# EAGLE design Indev 4_test (EAGLE 6.4)
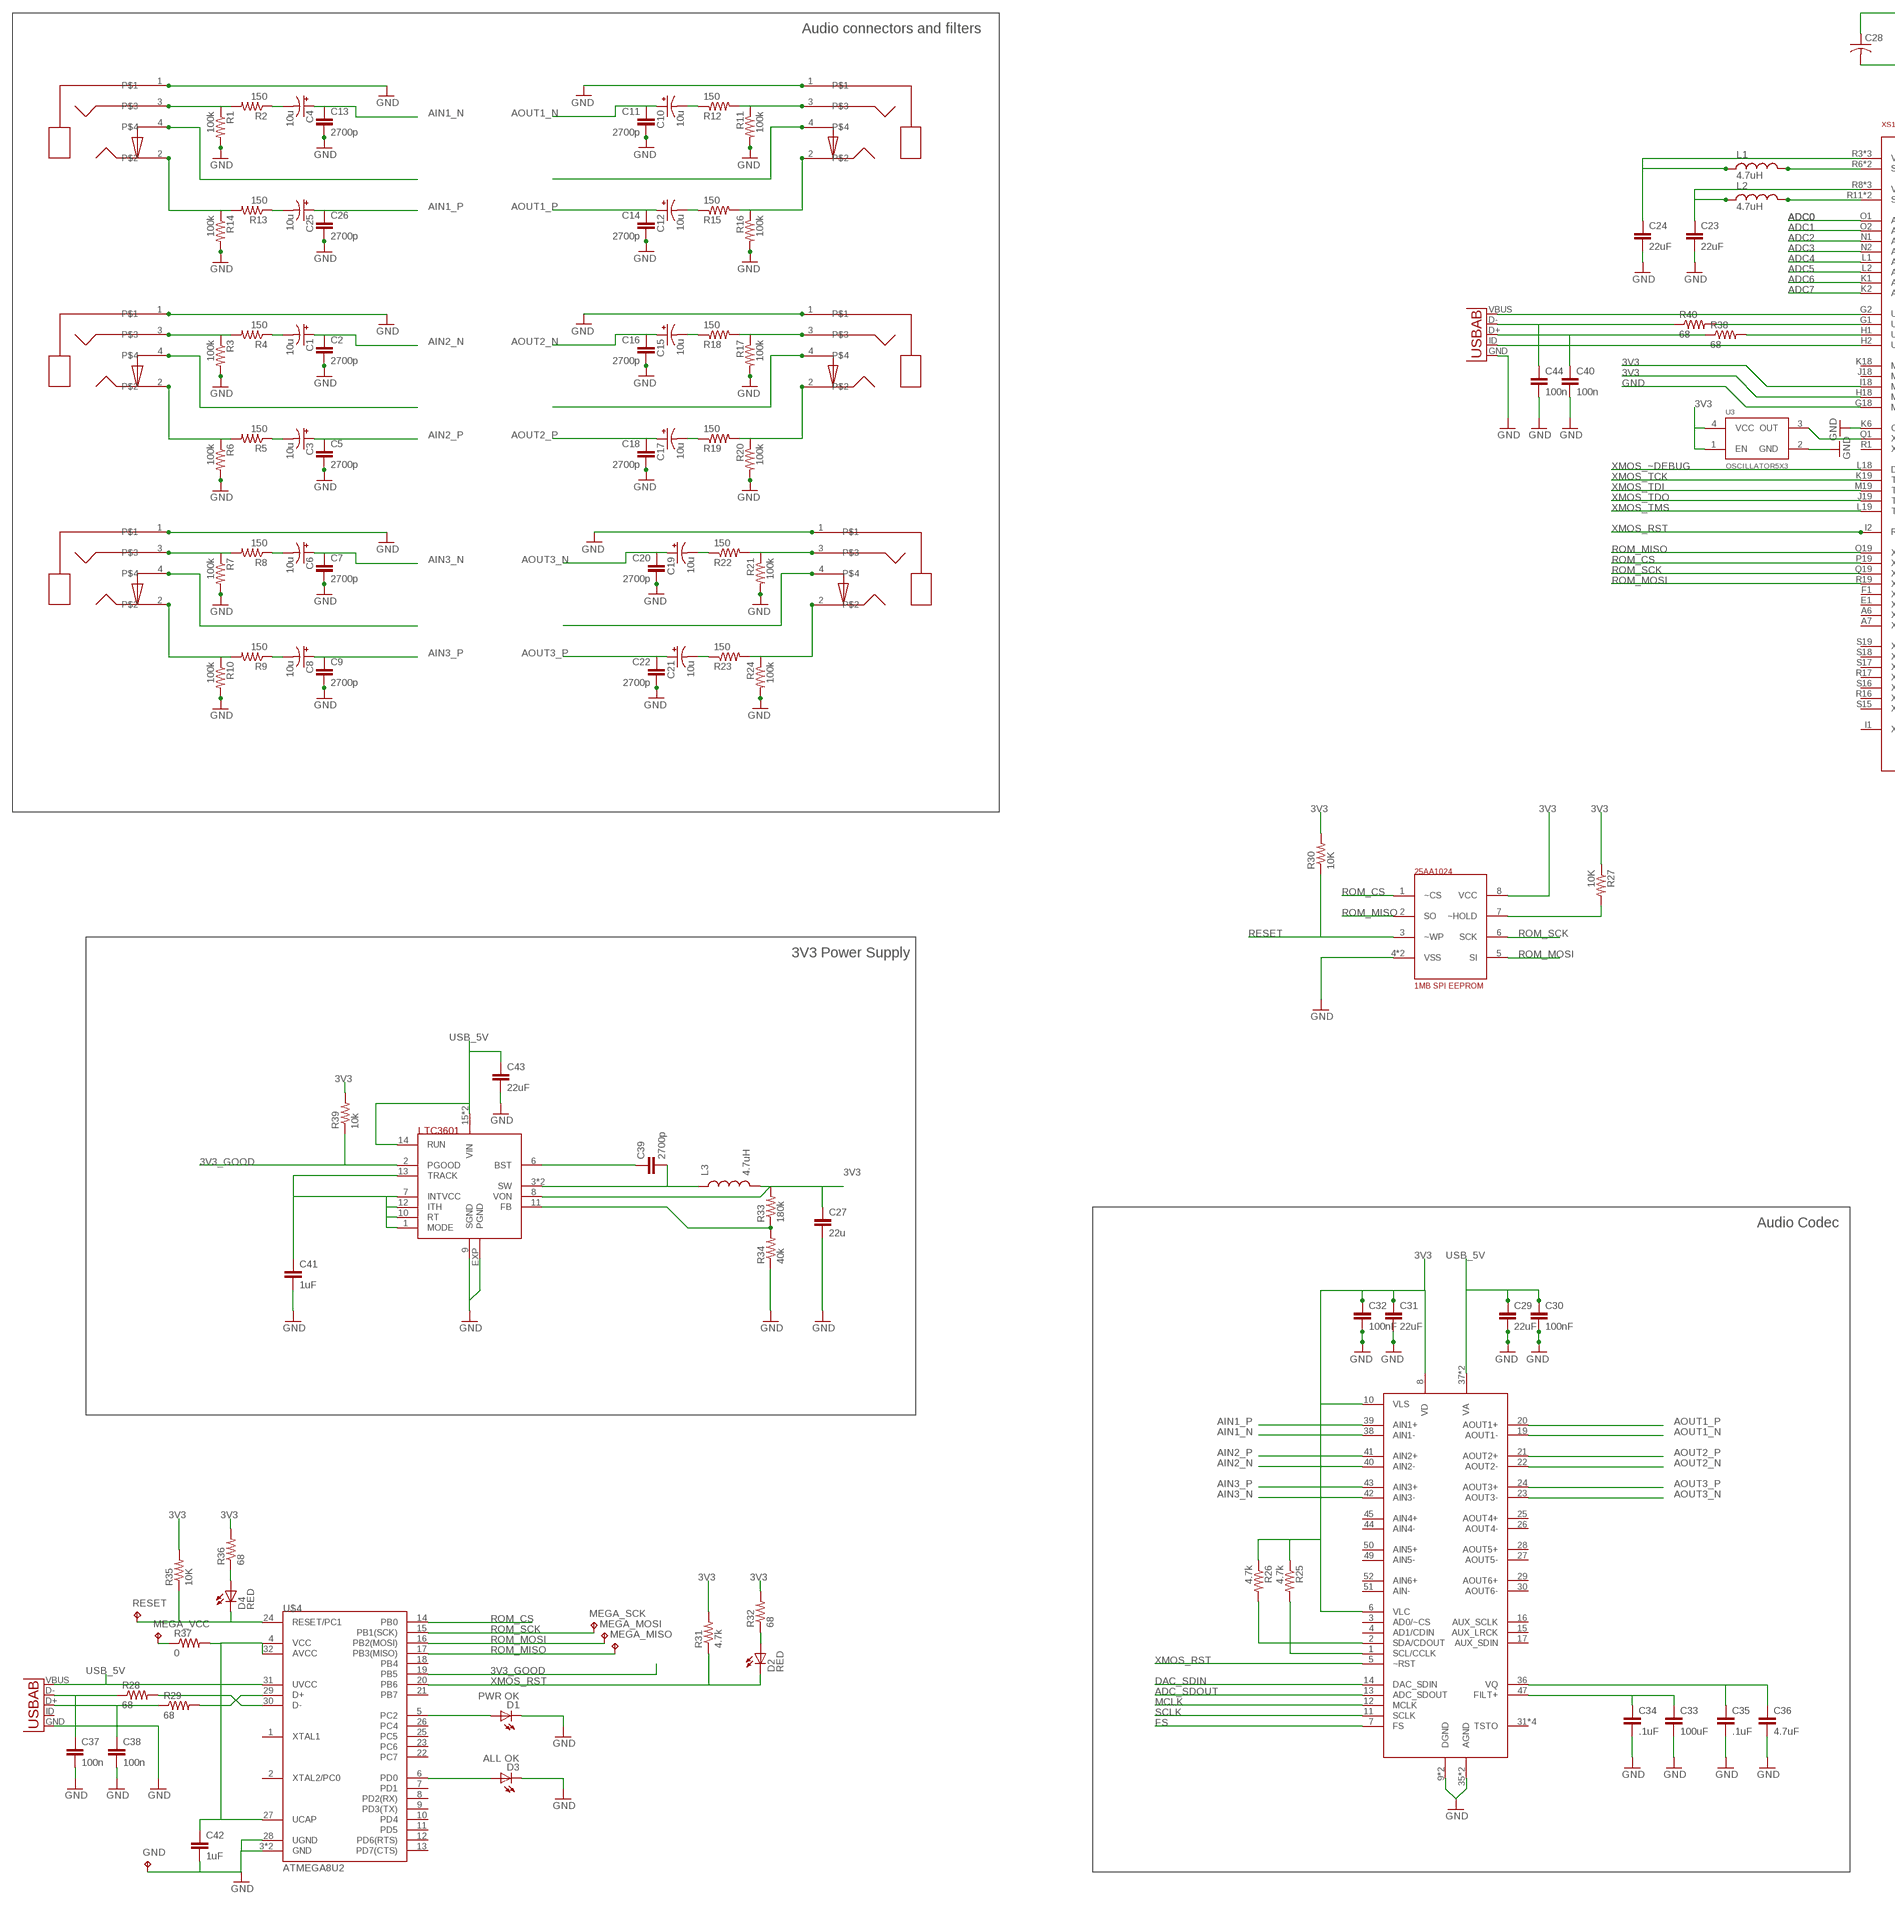
[diagram p0: schematic, sheet 1, part 1 of 2]
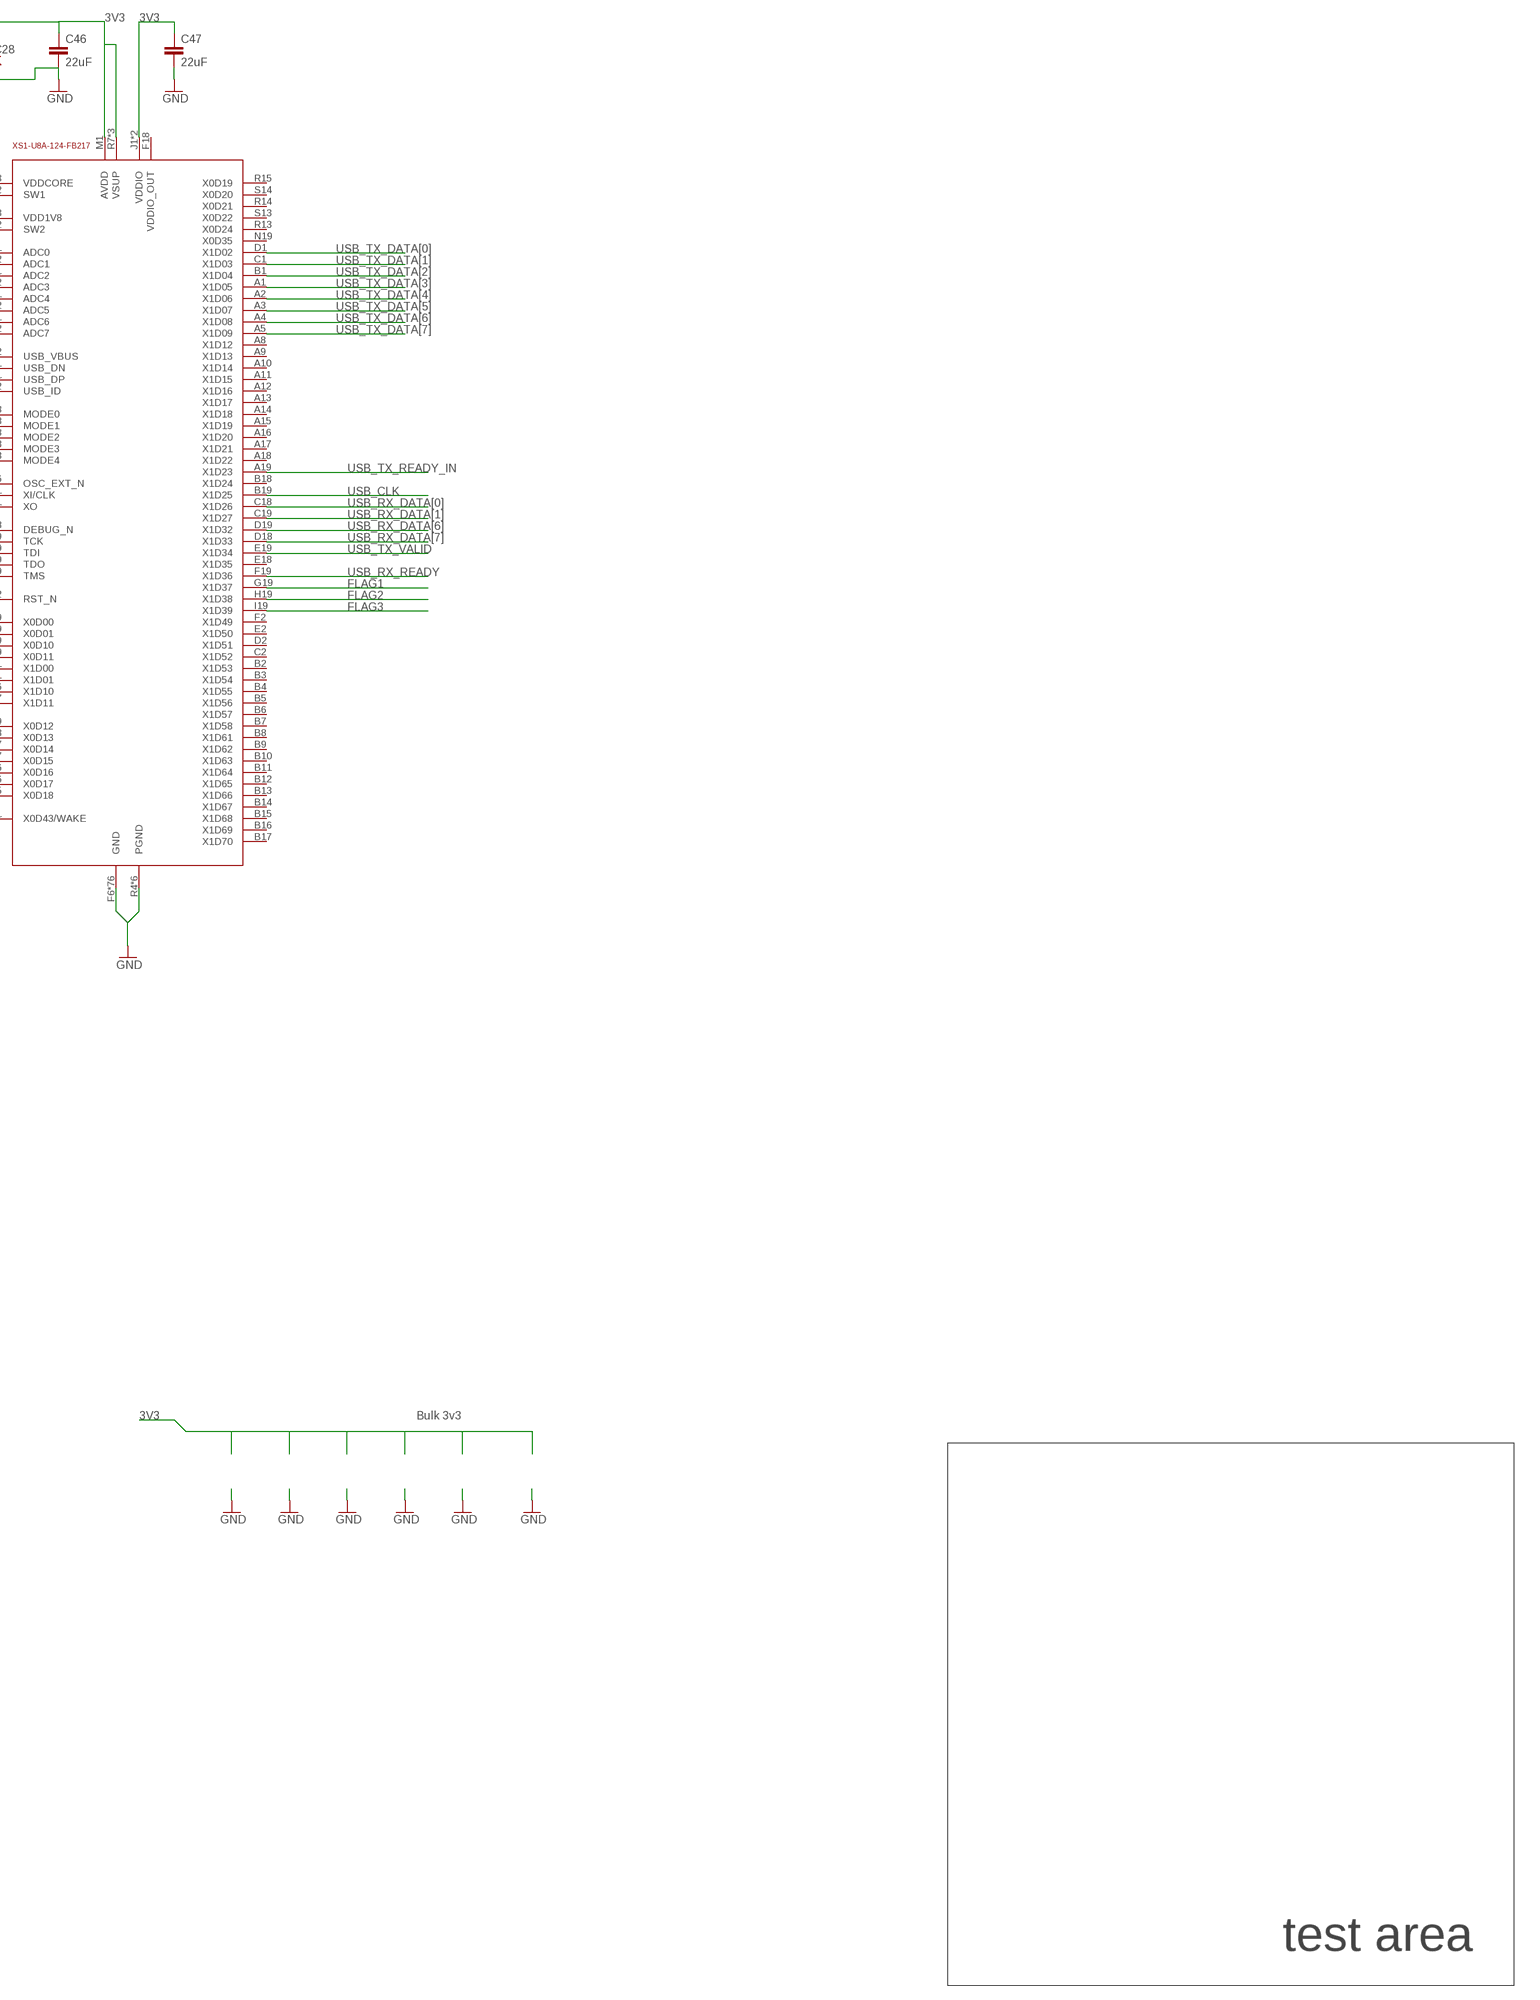
[diagram p1: schematic, sheet 1, part 2 of 2]

## Parts
C1  10u  CPOL-USB  [PANASONIC_B]
C2  2700p  CAP0402-CAP  [0402-CAP]
C3  10u  CPOL-USB  [PANASONIC_B]
C4  10u  CPOL-USB  [PANASONIC_B]
C5  2700p  CAP0402-CAP  [0402-CAP]
C6  10u  CPOL-USB  [PANASONIC_B]
C7  2700p  CAP0402-CAP  [0402-CAP]
C8  10u  CPOL-USB  [PANASONIC_B]
C9  2700p  CAP0402-CAP  [0402-CAP]
C10  10u  CPOL-USB  [PANASONIC_B]
C11  2700p  CAP0402-CAP  [0402-CAP]
C12  10u  CPOL-USB  [PANASONIC_B]
C13  2700p  CAP0402-CAP  [0402-CAP]
C14  2700p  CAP0402-CAP  [0402-CAP]
C15  10u  CPOL-USB  [PANASONIC_B]
C16  2700p  CAP0402-CAP  [0402-CAP]
C17  10u  CPOL-USB  [PANASONIC_B]
C18  2700p  CAP0402-CAP  [0402-CAP]
C19  10u  CPOL-USB  [PANASONIC_B]
C20  2700p  CAP0402-CAP  [0402-CAP]
C21  10u  CPOL-USB  [PANASONIC_B]
C22  2700p  CAP0402-CAP  [0402-CAP]
C23  22uF  CAP0402-CAP  [0402-CAP]
C24  22uF  CAP0402-CAP  [0402-CAP]
C25  10u  CPOL-USB  [PANASONIC_B]
C26  2700p  CAP0402-CAP  [0402-CAP]
C27  22u  CAP0603-CAP  [0603-CAP]
C28  C-USC0402  [C0402]
C29  22uF  CAP0402-CAP  [0402-CAP]
C30  100nF  CAP0402-CAP  [0402-CAP]
C31  22uF  CAP0402-CAP  [0402-CAP]
C32  100nF  CAP0402-CAP  [0402-CAP]
C33  100uF  CAP1206  [1206]
C34  .1uF  CAP0402-CAP  [0402-CAP]
C35  .1uF  CAP0402-CAP  [0402-CAP]
C36  4.7uF  CAP0402-CAP  [0402-CAP]
C37  100n  CAP0402-CAP  [0402-CAP]
C38  100n  CAP0402-CAP  [0402-CAP]
C39  2700p  CAP0402-CAP  [0402-CAP]
C40  100n  CAP0402-CAP  [0402-CAP]
C41  1uF  CAP0402-CAP  [0402-CAP]
C42  1uF  CAP0402-CAP  [0402-CAP]
C43  22uF  CAP0402-CAP  [0402-CAP]
C44  100n  CAP0402-CAP  [0402-CAP]
C46  22uF  CAP0402-CAP  [0402-CAP]
C47  22uF  CAP0402-CAP  [0402-CAP]
D1  PWR OK  LED-GREEN0603  [LED-0603]
D2  RED  LED-RED0603  [LED-0603]
D3  ALL OK  LED-BLUE0603  [LED-0603]
D4  RED  LED-RED0603  [LED-0603]
GND  TPB1,27  [B1,27]
J1  SJ1-3514-SMT  [SJ1-3514-SMT]
J2  SJ1-3514-SMT  [SJ1-3514-SMT]
J3  SJ1-3514-SMT  [SJ1-3514-SMT]
J4  SJ1-3514-SMT  [SJ1-3514-SMT]
J5  SJ1-3514-SMT  [SJ1-3514-SMT]
J6  SJ1-3514-SMT  [SJ1-3514-SMT]
L1  4.7uH  MDMK2020T4R7MM  [IND-2020]
L2  4.7uH  MDMK2020T4R7MM  [IND-2020]
L3  4.7uH  INDUCTOR1210  [1210]
MEGA_MISO  TPB1,27  [B1,27]
MEGA_MOSI  TPB1,27  [B1,27]
MEGA_SCK  TPB1,27  [B1,27]
MEGA_VCC  TPB1,27  [B1,27]
R1  100k  R-US_R0402  [R0402]
R2  150  R-US_R0402  [R0402]
R3  100k  R-US_R0402  [R0402]
R4  150  R-US_R0402  [R0402]
R5  150  R-US_R0402  [R0402]
R6  100k  R-US_R0402  [R0402]
R7  100k  R-US_R0402  [R0402]
R8  150  R-US_R0402  [R0402]
R9  150  R-US_R0402  [R0402]
R10  100k  R-US_R0402  [R0402]
R11  100k  R-US_R0402  [R0402]
R12  150  R-US_R0402  [R0402]
R13  150  R-US_R0402  [R0402]
R14  100k  R-US_R0402  [R0402]
R15  150  R-US_R0402  [R0402]
R16  100k  R-US_R0402  [R0402]
R17  100k  R-US_R0402  [R0402]
R18  150  R-US_R0402  [R0402]
R19  150  R-US_R0402  [R0402]
R20  100k  R-US_R0402  [R0402]
R21  100k  R-US_R0402  [R0402]
R22  150  R-US_R0402  [R0402]
R23  150  R-US_R0402  [R0402]
R24  100k  R-US_R0402  [R0402]
R25  4.7k  R-US_R0402  [R0402]
R26  4.7k  R-US_R0402  [R0402]
R27  10K  R-US_R0402  [R0402]
R28  68  R-US_R0402  [R0402]
R29  68  R-US_R0402  [R0402]
R30  10K  R-US_R0402  [R0402]
R31  4.7k  RESISTOR0402-RES  [0402-RES]
R32  68  RESISTOR0402-RES  [0402-RES]
R33  180k  R-US_R0402  [R0402]
R34  40k  R-US_R0402  [R0402]
R35  10K  R-US_R0402  [R0402]
R36  68  RESISTOR0402-RES  [0402-RES]
R37  0  RESISTOR0603-RES  [0603-RES]
R38  68  R-US_R0402  [R0402]
R39  10k  R-US_R0402  [R0402]
R40  68  R-US_R0402  [R0402]
RESET  TPB1,27  [B1,27]
U1  USB-AB  [USB-AB-MICRO-SMD]
U3  OSCILLATOR5X3  [CRYSTAL-SMD-5X3]
U$1  LTC3601  [QFN16-3X3]
U$2  25AA1024DFN  [DFN8-5X6]
U$3  CS42436  [QFP-52]
U$4  ATMEGA8U2  [QFN-32]
U$5  USB_AB  [USB-AB-MICRO-SMD]
U$6  XS1-U8A-124-FB217  [217-BGA(.8MM)]

## Nets
3V3: C27.1 C28.1 C31.1 C32.1 C46.1 C47.1 L3.2 R25.1 R26.1 R27.1 R30.2 R31.2 R32.2 R33.2 R35.2 R36.2 R39.2 U3.1(EN) U3.4(VCC) U$1.8(VON) U$2.8(VCC) U$3.6(VLC) U$3.8(VD) U$3.10(VLS) U$6.H18(MODE3) U$6.I18(MODE2) U$6.J1(VDDIO) U$6.J2(VDDIO) U$6.M1(AVDD) U$6.R7(VSUP) U$6.S1(VSUP) U$6.S7(VSUP)
3V3_GOOD: R39.1 U$1.2(PGOOD) U$4.19(PB5)
ADC0: U$6.O1(ADC0)
ADC1: U$6.O2(ADC1)
ADC2: U$6.N1(ADC2)
ADC3: U$6.N2(ADC3)
ADC4: U$6.L1(ADC4)
ADC5: U$6.L2(ADC5)
ADC6: U$6.K1(ADC6)
ADC7: U$6.K2(ADC7)
ADC_SDOUT: U$3.13(ADC_SDOUT)
AIN1_N: C4.+ C13.1 U$3.38(AIN1-)
AIN1_P: C25.+ C26.1 U$3.39(AIN1+)
AIN2_N: C1.+ C2.1 U$3.40(AIN2-)
AIN2_P: C3.+ C5.1 U$3.41(AIN2+)
AIN3_N: C6.+ C7.1 U$3.42(AIN3-)
AIN3_P: C8.+ C9.1 U$3.43(AIN3+)
AOUT1_N: C10.+ C11.1 U$3.19(AOUT1-)
AOUT1_P: C12.+ C14.1 U$3.20(AOUT1+)
AOUT2_N: C15.+ C16.1 U$3.22(AOUT2-)
AOUT2_P: C17.+ C18.1 U$3.21(AOUT2+)
AOUT3_N: C19.+ C20.1 U$3.23(AOUT3-)
AOUT3_P: C21.+ C22.1 U$3.24(AOUT3+)
CH1_IN: J1.4
CH1O_IN: J4.4
CH2_IN: J2.4
CH2O_IN: J5.4
CH3_IN: J3.4
CH3O_IN: J6.4
DAC_SDIN: U$3.14(DAC_SDIN)
FB: R33.1 R34.2 U$1.11(FB)
FILT+: C33.1 C34.1 U$3.47(FILT+)
FLAG1: U$6.G19(X1D37)
FLAG2: U$6.H19(X1D38)
FLAG3: U$6.I19(X1D39)
FS: U$3.7(FS)
GND: C2.2 C5.2 C7.2 C9.2 C11.2 C13.2 C14.2 C16.2 C18.2 C20.2 C22.2 C23.2 C24.2 C26.2 C27.2 C28.2 C29.2 C30.2 C31.2 C32.2 C33.2 C34.2 C35.2 C36.2 C37.2 C38.2 C40.2 C41.2 C42.2 C43.2 C44.2 C46.2 C47.2 D1.C D3.C GND.TP J1.1 J2.1 J3.1 J4.1 J5.1 J6.1 R1.2 R3.2 R6.2 R7.2 R10.2 R11.2 R14.2 R16.2 R17.2 R20.2 R21.2 R24.2 R34.1 U1.GND U3.2(GND) U$1.9(SGND) U$1.EXP(PGND) U$2.4(VSS) U$2.PAD(VSS) U$3.9(DGND) U$3.18(DGND) U$3.35(AGND) U$3.48(AGND) U$4.3(GND) U$4.28(UGND) U$4.EP(GND) U$5.GND U$6.F6(GND) U$6.F7(GND) U$6.F8(GND) U$6.F9(GND) U$6.F10(GND) U$6.F11(GND) U$6.F12(GND) U$6.F13(GND) U$6.F14(GND) U$6.G6(GND) U$6.G7(GND) U$6.G8(GND) U$6.G9(GND) U$6.G10(GND) U$6.G11(GND) U$6.G12(GND) U$6.G13(GND) U$6.G14(GND) U$6.G18(MODE4) U$6.H6(GND) U$6.H7(GND) U$6.H8(GND) U$6.H9(GND) U$6.H10(GND) U$6.H11(GND) U$6.H12(GND) U$6.H13(GND) U$6.H14(GND) U$6.I6(GND) U$6.I7(GND) U$6.I8(GND) U$6.I9(GND) U$6.I10(GND) U$6.I11(GND) U$6.I12(GND) U$6.I13(GND) U$6.I14(GND) U$6.J6(GND) U$6.J7(GND) U$6.J8(GND) U$6.J9(GND) U$6.J10(GND) U$6.J11(GND) U$6.J12(GND) U$6.J13(GND) U$6.J14(GND) U$6.K6(OSC_EXT_N) U$6.K7(GND) U$6.K8(GND) U$6.K9(GND) U$6.K10(GND) U$6.K11(GND) U$6.K12(GND) U$6.K13(GND) U$6.K14(GND) U$6.L8(GND) U$6.L9(GND) U$6.L10(GND) U$6.L11(GND) U$6.L12(GND) U$6.L13(GND) U$6.L14(GND) U$6.M8(GND) U$6.M9(GND) U$6.M10(GND) U$6.M11(GND) U$6.M12(GND) U$6.M13(GND) U$6.M14(GND) U$6.N6(GND) U$6.N7(GND) U$6.N8(GND) U$6.N9(GND) U$6.N10(GND) U$6.N11(GND) U$6.N12(GND) U$6.N13(GND) U$6.N14(GND) U$6.R4(PGND) U$6.R5(PGND) U$6.R9(PGND) U$6.R10(PGND) U$6.S5(PGND) U$6.S10(PGND)
LED_N: D3.A U$4.6(PD0)
LED_P: D1.A U$4.5(PC2)
MCLK: U$3.12(MCLK)
MEGA_VCC: C42.1 R37.2 U$4.4(VCC) U$4.27(UCAP) U$4.32(AVCC)
N$1: J1.2 R13.2 R14.1
N$2: J1.3 R1.1 R2.2
N$3: C4.- R2.1
N$4: D4.A R36.1
N$5: C25.- R13.1
N$6: MEGA_VCC.TP R37.1
N$7: U3.3(OUT) U$6.Q1(XI/CLK)
N$8: J2.3 R3.1 R4.2
N$9: C1.- R4.1
N$10: D2.A R32.1
N$11: J2.2 R5.2 R6.1
N$12: C3.- R5.1
N$13: U$5.VBUS U$6.G2(USB_VBUS)
N$15: J3.3 R7.1 R8.2
N$16: C6.- R8.1
N$18: J3.2 R9.2 R10.1
N$19: C8.- R9.1
N$20: C39.1 U$1.6(BST)
N$21: U$5.ID(USBID) U$6.H2(USB_ID)
N$22: J4.3 R11.1 R12.2
N$23: C10.- R12.1
N$24: C37.1 R28.1 U1.D-
N$25: J4.2 R15.2 R16.1
N$26: C12.- R15.1
N$29: J5.3 R17.1 R18.2
N$30: C15.- R18.1
N$31: R25.2 U$3.1(SCL/CCLK)
N$32: J5.2 R19.2 R20.1
N$33: C17.- R19.1
N$34: R26.2 U$3.2(SDA/CDOUT)
N$36: J6.3 R21.1 R22.2
N$37: C19.- R22.1
N$39: J6.2 R23.2 R24.1
N$40: C21.- R23.1
N$41: C38.1 R29.1 U1.D+
N$46: R27.2 U$2.7(~HOLD)
PROG_USB_N: R28.2 U$4.30(D-)
PROG_USB_P: R29.2 U$4.29(D+)
RESET: D4.C R30.1 R35.1 RESET.TP U$2.3(~WP) U$4.24(RESET/PC1)
ROM_CS: U$2.1(~CS) U$4.14(PB0) U$6.P19(X0D01)
ROM_MISO: MEGA_MISO.TP U$2.2(SO) U$4.17(PB3(MISO)) U$6.O19(X0D00)
ROM_MOSI: MEGA_MOSI.TP U$2.5(SI) U$4.16(PB2(MOSI)) U$6.R19(X0D11)
ROM_SCK: MEGA_SCK.TP U$2.6(SCK) U$4.15(PB1(SCK)) U$6.Q19(X0D10)
SCLK: U$3.11(SCLK)
SW: C39.2 L3.1 U$1.3(SW) U$1.4(SW)
SW1: L1.P$2 U$6.R6(SW1) U$6.S6(SW1)
SW2: L2.P$2 U$6.R11(SW2) U$6.S11(SW2)
TRACK/SS: C41.1 U$1.1(MODE) U$1.7(INTVCC) U$1.10(RT) U$1.12(ITH) U$1.13(TRACK)
USB2_N: R40.2 U$6.G1(USB_DN)
USB2_P: R38.2 U$6.H1(USB_DP)
USB2R_N: C44.1 R40.1 U$5.D-
USB2R_P: C40.1 R38.1 U$5.D+
USB_5V: C29.1 C30.1 C43.1 U1.VBUS U$1.14(RUN) U$1.15(VIN) U$1.16(VIN) U$3.37(VA) U$3.46(VA) U$4.31(UVCC)
USB_CLK: U$6.B19(X1D25)
USB_RX_DATA[0]: U$6.C18(X1D26)
USB_RX_DATA[1]: U$6.C19(X1D27)
USB_RX_DATA[6]: U$6.D19(X1D32)
USB_RX_DATA[7]: U$6.D18(X1D33)
USB_RX_READY: U$6.F19(X1D36)
USB_TX_DATA[0]: U$6.D1(X1D02)
USB_TX_DATA[1]: U$6.C1(X1D03)
USB_TX_DATA[2]: U$6.B1(X1D04)
USB_TX_DATA[3]: U$6.A1(X1D05)
USB_TX_DATA[4]: U$6.A2(X1D06)
USB_TX_DATA[5]: U$6.A3(X1D07)
USB_TX_DATA[6]: U$6.A4(X1D08)
USB_TX_DATA[7]: U$6.A5(X1D09)
USB_TX_READY_IN: U$6.A19(X1D23)
USB_TX_VALID: U$6.E19(X1D34)
VDD1V8: C23.1 L2.P$1 U$6.R8(VDD1V8) U$6.S8(VDD1V8) U$6.S9(VDD1V8)
VDDCORE: C24.1 L1.P$1 U$6.R3(VDDCORE) U$6.S3(VDDCORE) U$6.S4(VDDCORE)
VQ: C35.1 C36.1 U$3.36(VQ)
XMOS_RST: D2.C R31.1 U$3.5(~RST) U$4.20(PB6) U$6.I2(RST_N)
XMOS_TCK: U$6.K19(TCK)
XMOS_TDI: U$6.M19(TDI)
XMOS_TDO: U$6.J19(TDO)
XMOS_TMS: U$6.L19(TMS)
XMOS_~DEBUG: U$6.L18(DEBUG_N)
Unconnected: U1.ID(USBID) U$3.3(AD0/~CS) U$3.4(AD1/CDIN) U$3.15(AUX_LRCK) U$3.16(AUX_SCLK) U$3.17(AUX_SDIN) U$3.25(AOUT4+) U$3.26(AOUT4-) U$3.27(AOUT5-) U$3.28(AOUT5+) U$3.29(AOUT6+) U$3.30(AOUT6-) U$3.31(TSTO) U$3.32(TSTO) U$3.33(TSTO) U$3.34(TSTO) U$3.44(AIN4-) U$3.45(AIN4+) U$3.49(AIN5-) U$3.50(AIN5+) U$3.51(AIN-) U$3.52(AIN6+) U$4.1(XTAL1) U$4.2(XTAL2/PC0) U$4.7(PD1) U$4.8(PD2(RX)) U$4.9(PD3(TX)) U$4.10(PD4) U$4.11(PD5) U$4.12(PD6(RTS)) U$4.13(PD7(CTS)) U$4.18(PB4) U$4.21(PB7) U$4.22(PC7) U$4.23(PC6) U$4.25(PC5) U$4.26(PC4) U$6.A6(X1D10) U$6.A7(X1D11) U$6.A8(X1D12) U$6.A9(X1D13) U$6.A10(X1D14) U$6.A11(X1D15) U$6.A12(X1D16) U$6.A13(X1D17) U$6.A14(X1D18) U$6.A15(X1D19) U$6.A16(X1D20) U$6.A17(X1D21) U$6.A18(X1D22) U$6.B2(X1D53) U$6.B3(X1D54) U$6.B4(X1D55) U$6.B5(X1D56) U$6.B6(X1D57) U$6.B7(X1D58) U$6.B8(X1D61) U$6.B9(X1D62) U$6.B10(X1D63) U$6.B11(X1D64) U$6.B12(X1D65) U$6.B13(X1D66) U$6.B14(X1D67) U$6.B15(X1D68) U$6.B16(X1D69) U$6.B17(X1D70) U$6.B18(X1D24) U$6.C2(X1D52) U$6.D2(X1D51) U$6.E1(X1D01) U$6.E2(X1D50) U$6.E18(X1D35) U$6.F1(X1D00) U$6.F2(X1D49) U$6.F18(VDDIO_OUT) U$6.I1(X0D43/WAKE) U$6.J18(MODE1) U$6.K18(MODE0) U$6.N19(X0D35) U$6.R1(XO) U$6.R13(X0D24) U$6.R14(X0D21) U$6.R15(X0D19) U$6.R16(X0D17) U$6.R17(X0D15) U$6.S13(X0D22) U$6.S14(X0D20) U$6.S15(X0D18) U$6.S16(X0D16) U$6.S17(X0D14) U$6.S18(X0D13) U$6.S19(X0D12)

## Notes on the sheet
- Audio connectors and filters
- 3V3 Power Supply
- Audio Codec
- Bulk 3v3
- test area

## Library data of the parts
C1 C3 C4 C6 C8 C10 C12 C15 C17 C19 C21 C25 = adafruit:CPOL-US: POLARIZED CAPACITOR, American symbol
C2 C5 C7 C9 C11 C13 C14 C16 C18 C20 C22-C24 C26 C29-C44 C46 C47 = SparkFun-Capacitors:CAP: Capacitor Standard 0603 ceramic capacitor, and 0.1" leaded capacitor.
C27 = 1x05smd:CAP: Capacitor Standard 0603 ceramic capacitor, and 0.1" leaded capacitor.
C28 = adafruit:C-US: CAPACITOR, American symbol
D1 = SparkFun-LED:LED-GREEN: Various green LEDs 0603- DIO-00821 LARGE- DIO-00862 LILYPAD- DIO-09910; PROD_ID: DIO-00821; VALUE: GREEN
D2 D4 = SparkFun-LED:LED-RED: Assorted Red LEDs LilyPad 1206- DIO-09912 1206- DIO-00809 0603- DIO-00819; PROD_ID: DIO-00819
D3 = SparkFun-LED:LED-BLUE: Blue LEDs for production use Various blue LEDs stocked by SparkFun production 0603 - DIO-08575 Rebel - DIO-09553 1206 - DIO-09911; PROD_ID: DIO-08575; VALUE: BLUE
GND MEGA_MISO MEGA_MOSI MEGA_SCK MEGA_VCC RESET = testpad:TP: Test pad
J1-J6 = Strutz Electronic Industries:SJ1-3514-SMT
L1 L2 = Strutz Electronic Industries:MDMK2020T4R7MM
L3 = SparkFun-Passives:INDUCTOR: Inductors Basic Inductor/Choke - 0603 and 1206. Footprints are not proven and vary greatly between part numbers. SRN6045- 33uH, 20% 1.4A SDR0403-560KL - 56uH, 10%, 500mA RMS/740mA peak
R1-R30 R33-R35 R38-R40 = adafruit:R-US_: RESISTOR, American symbol
R31 R32 R36 R37 = 1x05smd:RESISTOR: Resistor Basic schematic elements and footprints for 0603, 1206, and PTH 1/10th watt (small) resistors.
U1 = SparkFun-Connectors:USB-AB: This is a USB AB connector that is compatible with USB OTG. i.e. this connector can serve as a host or device
U3 = SparkFun-FreqCtrl:OSCILLATOR: Generic 5x3 and 7x5 oscillators
U$1 = Strutz Electronic Industries:LTC3601
U$2 = Strutz Electronic Industries:25AA1024: 1MB SPI EEPROM from Microchip Comes in PDIP, SSOP, DFN
U$3 = Strutz Electronic Industries:CS42436
U$4 = Strutz Electronic Industries:ATMEGA8U2
U$5 = SparkFun-Connectors:USB_AB: This is a USB AB connector that is compatible with USB OTG. i.e. this connector can serve as a host or device
U$6 = Strutz Electronic Industries:XS1-U8A-124-FB217

## Board
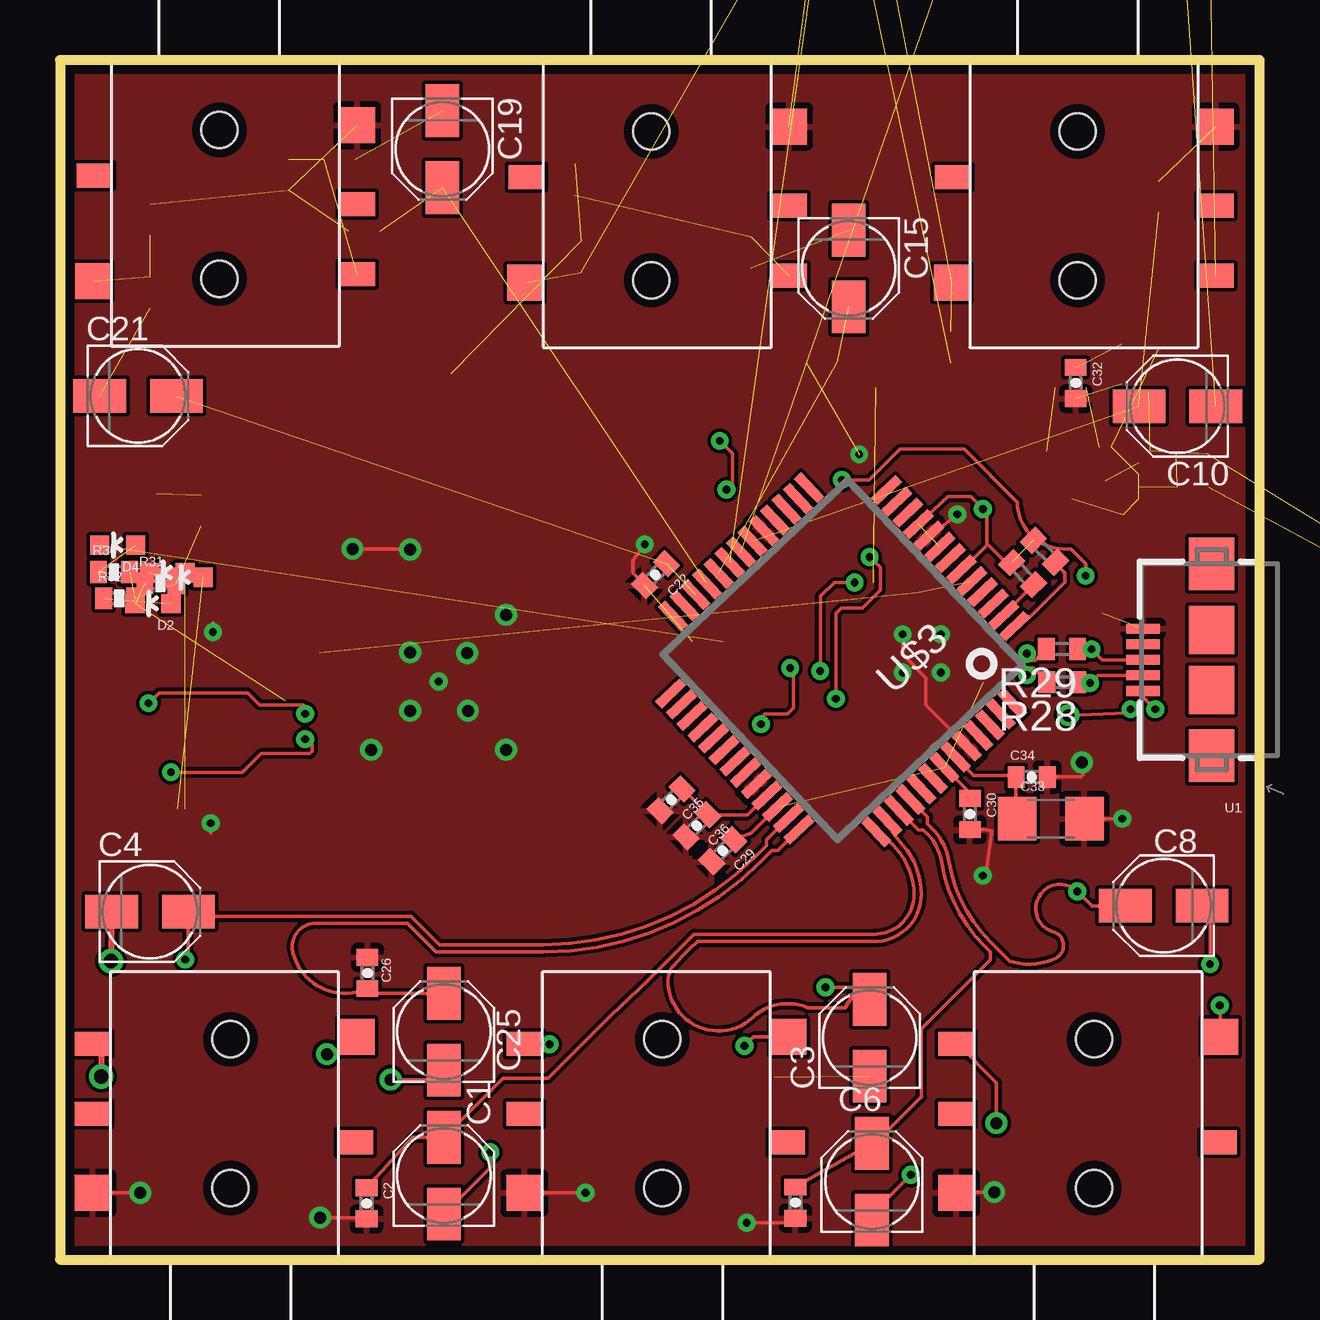
[diagram p2: board, top side]
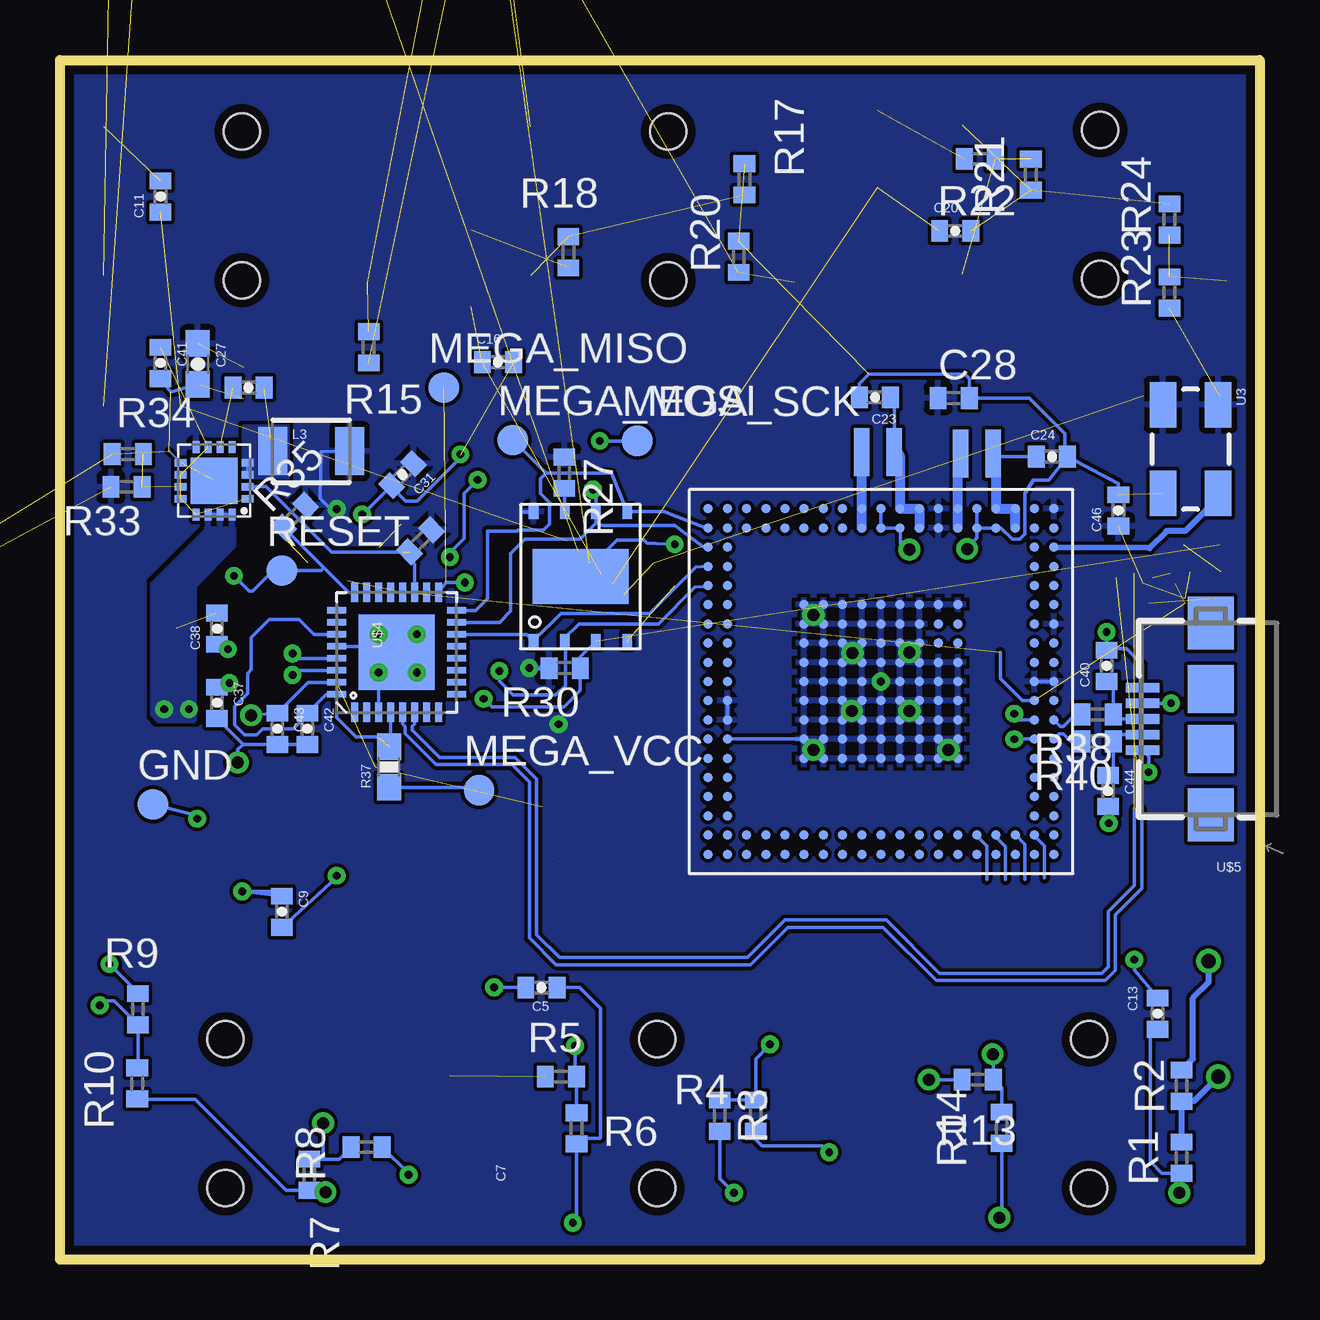
[diagram p3: board, bottom side, seen from below]

Size 50 x 50 mm. Coordinates in mm from the lower left corner, seen from the top.
Outline: 0,0 50,0 50,50 0,50 0,0
Copper layers (1*16): Top 0.035mm / dielectric 1.5mm / Bottom 0.035mm
Design rules "default *": minimum track width 6mil, minimum drill 13mil, track to track 6mil, track to pad 6mil, pad to pad 6mil, via to via 6mil, smd to smd 6mil, copper to edge 15mil, drill to drill 6mil, minimum pad ring 10mil, minimum via ring 8mil, stop-mask expansion 4mil, vias tented up to drill 0mil, thermal gap 10mil

### Footprints (pad centres in the part's own frame; a part is rotated, then mirrored left to right if it is on the bottom)
PANASONIC_B = smd 2.2 x 1.4: + 1.6,0; - -1.6,0
0402-CAP = smd 0.7 x 0.9: 1 -0.65,0; 2 0.65,0
0603-CAP = smd 1.1 x 1: 1 -0.85,0; 2 0.85,0
C0402 = smd 0.7 x 0.9: 1 -0.65,0; 2 0.65,0
1206 = smd 1.6 x 1.8: 1 -1.4,0; 2 1.4,0
LED-0603 = smd 0.8 x 0.8: A 0,-0.75; C 0,0.75
B1,27 = smd 1.27 x 1.27: TP 0,0
SJ1-3514-SMT = smd 1.5 x 1.5: 1 -5.39,-2.97; 2 5.61,3.53 | smd 1.5 x 1: 3 -5.39,3.23; 4 5.56,-0.87; 5 -5.39,0.33 | hole 1.5: 0.36,-2.77; 0.36,3.43
IND-2020 = smd 0.65 x 2: P$1 0.325,1; P$2 1.675,1
1210 = smd 1.2 x 2: 1 -1.6,0; 2 1.6,0
R0402 = smd 0.7 x 0.9: 1 -0.65,0; 2 0.65,0
0402-RES = smd 0.7 x 0.9: 1 -0.65,0; 2 0.65,0
0603-RES = smd 1.1 x 1: 1 -0.85,0; 2 0.85,0
USB-AB-MICRO-SMD = smd 1.4 x 0.4: D+ 2.85,0; D- 2.85,0.65; GND 2.85,-1.3; ID 2.85,-0.65; VBUS 2.85,1.3 | smd 1.9 x 2: P$6 0,1.25; P$7 0,-1.25 | smd 1.9 x 2.2: P$8 0,4; P$9 0,-4
CRYSTAL-SMD-5X3 = smd 1.9 x 1.1: 1 -1.85,-1.15; 2 1.85,-1.15; 3 1.85,1.15; 4 -1.85,1.15
QFN16-3X3 = smd 0.5 x 0.3: 1 -1.4,0.75; 2 -1.4,0.25; 3 -1.4,-0.25; 4 -1.4,-0.75; 9 1.4,-0.75; 10 1.4,-0.25; 11 1.4,0.25; 12 1.4,0.75 | smd 0.3 x 0.5: 5 -0.75,-1.4; 6 -0.25,-1.4; 7 0.25,-1.4; 8 0.75,-1.4; 13 0.75,1.4; 14 0.25,1.4; 15 -0.25,1.4; 16 -0.75,1.4 | smd 1.95 x 1.95: EXP 0,0
DFN8-5X6 = smd 0.4 x 0.6: 1 -1.95,-2.7; 2 -0.65,-2.7; 3 0.65,-2.7; 4 1.95,-2.7; 5 1.95,2.7; 6 0.65,2.7; 7 -0.65,2.7; 8 -1.95,2.7 | smd 4 x 2.31: PAD 0,0
QFP-52 = smd 1.4 x 0.4: 1 -6.175,3.9; 2 -6.175,3.25; 3 -6.175,2.6; 4 -6.175,1.95; 5 -6.175,1.3; 6 -6.175,0.65; 7 -6.175,0; 8 -6.175,-0.65; 9 -6.175,-1.3; 10 -6.175,-1.95; 11 -6.175,-2.6; 12 -6.175,-3.25; 13 -6.175,-3.9; 27 6.175,-3.9; 28 6.175,-3.25; 29 6.175,-2.6; 30 6.175,-1.95; 31 6.175,-1.3; 32 6.175,-0.65; 33 6.175,0; 34 6.175,0.65; 35 6.175,1.3; 36 6.175,1.95; 37 6.175,2.6; 38 6.175,3.25; 39 6.175,3.9 | smd 0.4 x 1.4: 14 -3.9,-6.175; 15 -3.25,-6.175; 16 -2.6,-6.175; 17 -1.95,-6.175; 18 -1.3,-6.175; 19 -0.65,-6.175; 20 0,-6.175; 21 0.65,-6.175; 22 1.3,-6.175; 23 1.95,-6.175; 24 2.6,-6.175; 25 3.25,-6.175; 26 3.9,-6.175; 40 3.9,6.175; 41 3.25,6.175; 42 2.6,6.175; 43 1.95,6.175; 44 1.3,6.175; 45 0.65,6.175; 46 0,6.175; 47 -0.65,6.175; 48 -1.3,6.175; 49 -1.95,6.175; 50 -2.6,6.175; 51 -3.25,6.175; 52 -3.9,6.175
QFN-32 = smd 0.8 x 0.285: 1 -2.5,1.75; 2 -2.5,1.25; 3 -2.5,0.75; 4 -2.5,0.25; 5 -2.5,-0.25; 6 -2.5,-0.75; 7 -2.5,-1.25; 8 -2.5,-1.75; 17 2.5,-1.75; 18 2.5,-1.25; 19 2.5,-0.75; 20 2.5,-0.25; 21 2.5,0.25; 22 2.5,0.75; 23 2.5,1.25; 24 2.5,1.75 | smd 0.285 x 0.8: 9 -1.75,-2.5; 10 -1.25,-2.5; 11 -0.75,-2.5; 12 -0.25,-2.5; 13 0.25,-2.5; 14 0.75,-2.5; 15 1.25,-2.5; 16 1.75,-2.5; 25 1.75,2.5; 26 1.25,2.5; 27 0.75,2.5; 28 0.25,2.5; 29 -0.25,2.5; 30 -0.75,2.5; 31 -1.25,2.5; 32 -1.75,2.5 | smd 3.15 x 3.15: EP 0,0
217-BGA(.8MM) = smd 0.4 x 0.4: A1 -7.2,7.2; A2 -6.4,7.2; A3 -5.6,7.2; A4 -4.8,7.2; A5 -4,7.2; A6 -3.2,7.2; A7 -2.4,7.2; A8 -1.6,7.2; A9 -0.8,7.2; A10 0,7.2; A11 0.8,7.2; A12 1.6,7.2; A13 2.4,7.2; A14 3.2,7.2; A15 4,7.2; A16 4.8,7.2; A17 5.6,7.2; A18 6.4,7.2; A19 7.2,7.2; B1 -7.2,6.4; B2 -6.4,6.4; B3 -5.6,6.4; B4 -4.8,6.4; B5 -4,6.4; B6 -3.2,6.4; B7 -2.4,6.4; B8 -1.6,6.4; B9 -0.8,6.4; B10 0,6.4; B11 0.8,6.4; B12 1.6,6.4; B13 2.4,6.4; B14 3.2,6.4; B15 4,6.4; B16 4.8,6.4; B17 5.6,6.4; B18 6.4,6.4; B19 7.2,6.4; C1 -7.2,5.6; C2 -6.4,5.6; C18 6.4,5.6; C19 7.2,5.6; D1 -7.2,4.8; D2 -6.4,4.8; D18 6.4,4.8; D19 7.2,4.8; E1 -7.2,4; E2 -6.4,4; E18 6.4,4; E19 7.2,4; F1 -7.2,3.2; F2 -6.4,3.2; F6 -3.2,3.2; F7 -2.4,3.2; F8 -1.6,3.2; F9 -0.8,3.2; F10 0,3.2; F11 0.8,3.2; F12 1.6,3.2; F13 2.4,3.2; F14 3.2,3.2; F18 6.4,3.2; F19 7.2,3.2; G1 -7.2,2.4; G2 -6.4,2.4; G6 -3.2,2.4; G7 -2.4,2.4; G8 -1.6,2.4; G9 -0.8,2.4; G10 0,2.4; G11 0.8,2.4; G12 1.6,2.4; G13 2.4,2.4; G14 3.2,2.4; G18 6.4,2.4; G19 7.2,2.4; H1 -7.2,1.6; H2 -6.4,1.6; H6 -3.2,1.6; H7 -2.4,1.6; H8 -1.6,1.6; H9 -0.8,1.6; H10 0,1.6; H11 0.8,1.6; H12 1.6,1.6; H13 2.4,1.6; H14 3.2,1.6; H18 6.4,1.6; H19 7.2,1.6; I1 -7.2,0.8; I2 -6.4,0.8; I6 -3.2,0.8; I7 -2.4,0.8; I8 -1.6,0.8; I9 -0.8,0.8; I10 0,0.8; I11 0.8,0.8; I12 1.6,0.8; I13 2.4,0.8; I14 3.2,0.8; I18 6.4,0.8; I19 7.2,0.8; J1 -7.2,0; J2 -6.4,0; J6 -3.2,0; J7 -2.4,0; J8 -1.6,0; J9 -0.8,0; J10 0,0; J11 0.8,0; J12 1.6,0; J13 2.4,0; J14 3.2,0; J18 6.4,0; J19 7.2,0; K1 -7.2,-0.8; K2 -6.4,-0.8; K6 -3.2,-0.8; K7 -2.4,-0.8; K8 -1.6,-0.8; K9 -0.8,-0.8; K10 0,-0.8; K11 0.8,-0.8; K12 1.6,-0.8; K13 2.4,-0.8; K14 3.2,-0.8; K18 6.4,-0.8; K19 7.2,-0.8; L1 -7.2,-1.6; L2 -6.4,-1.6; L6 -3.2,-1.6; L7 -2.4,-1.6; L8 -1.6,-1.6; L9 -0.8,-1.6; L10 0,-1.6; L11 0.8,-1.6; L12 1.6,-1.6; L13 2.4,-1.6; L14 3.2,-1.6; L18 6.4,-1.6; L19 7.2,-1.6; M1 -7.2,-2.4; M2 -6.4,-2.4; M6 -3.2,-2.4; M7 -2.4,-2.4; M8 -1.6,-2.4; M9 -0.8,-2.4; M10 0,-2.4; M11 0.8,-2.4; M12 1.6,-2.4; M13 2.4,-2.4; M14 3.2,-2.4; M18 6.4,-2.4; M19 7.2,-2.4; N1 -7.2,-3.2; N2 -6.4,-3.2; N6 -3.2,-3.2; N7 -2.4,-3.2; N8 -1.6,-3.2; N9 -0.8,-3.2; N10 0,-3.2; N11 0.8,-3.2; N12 1.6,-3.2; N13 2.4,-3.2; N14 3.2,-3.2; N18 6.4,-3.2; N19 7.2,-3.2; O1 -7.2,-4; O2 -6.4,-4; O18 6.4,-4; O19 7.2,-4; P1 -7.2,-4.8; P2 -6.4,-4.8; P18 6.4,-4.8; P19 7.2,-4.8; Q1 -7.2,-5.6; Q2 -6.4,-5.6; Q18 6.4,-5.6; Q19 7.2,-5.6; R1 -7.2,-6.4; R2 -6.4,-6.4; R3 -5.6,-6.4; R4 -4.8,-6.4; R5 -4,-6.4; R6 -3.2,-6.4; R7 -2.4,-6.4; R8 -1.6,-6.4; R9 -0.8,-6.4; R10 0,-6.4; R11 0.8,-6.4; R12 1.6,-6.4; R13 2.4,-6.4; R14 3.2,-6.4; R15 4,-6.4; R16 4.8,-6.4; R17 5.6,-6.4; R18 6.4,-6.4; R19 7.2,-6.4; S1 -7.2,-7.2; S2 -6.4,-7.2; S3 -5.6,-7.2; S4 -4.8,-7.2; S5 -4,-7.2; S6 -3.2,-7.2; S7 -2.4,-7.2; S8 -1.6,-7.2; S9 -0.8,-7.2; S10 0,-7.2; S11 0.8,-7.2; S12 1.6,-7.2; S13 2.4,-7.2; S14 3.2,-7.2; S15 4,-7.2; S16 4.8,-7.2; S17 5.6,-7.2; S18 6.4,-7.2; S19 7.2,-7.2

### Placement (x,y rotation side)
C1  16,3.5 90 top
C2  12.78,2.34 270 top
C3  33.75,9.25 90 top
C4  3.75,14.5 0 top
C5  29.93,11.34 0 bottom
C6  33.84,3.25 90 top
C7  30.66,2.38 270 top
C8  46,14.75 180 top
C9  40.75,14.5 270 bottom
C10  46.58,35.57 180 top
C11  45.81,44.31 90 bottom
C12  31.6,61.98 270 top  (outside the outline)
C13  4.25,10.25 270 bottom
C14  37.2,55.5 90 bottom  (outside the outline)
C15  32.88,41.31 270 top
C16  31.75,37.41 0 bottom
C17  21.24,61.84 270 top  (outside the outline)
C18  31.57,55.67 90 bottom  (outside the outline)
C19  15.94,46.28 270 top
C20  12.69,42.88 0 bottom
C21  3.25,36 0 top
C22  24.82,28.55 225 top
C23  16.03,35.94 180 bottom
C24  8.66,33.47 0 bottom
C25  16,9.5 90 top
C26  12.82,11.94 90 top
C27  44.26,37.33 270 bottom
C28  12.75,35.91 0 bottom
C29  27.62,17.04 225 top
C30  37.93,18.56 270 top
C31  35.72,32.72 225 bottom
C32  42.34,36.54 270 top
C33  41.3,18.38 0 top
C34  40.5,20.11 0 top
C35  25.47,19.16 225 top
C36  26.55,18.08 225 top
C37  43.46,23.21 270 bottom
C38  43.46,26.3 90 bottom
C39  42.14,36.34 0 bottom
C40  6.38,24.75 90 bottom
C41  45.81,37.37 270 bottom
C42  39.69,22.12 270 bottom
C43  40.94,22.12 270 bottom
C44  6.31,19.53 270 bottom
C46  5.89,31.23 90 bottom
C47  55.76,28.31 0 top  (outside the outline)
D1  5.22,28.44 90 top
D2  3.88,27.34 90 top
D3  4.47,28.62 90 top
D4  2.41,29.78 90 top
GND  46.12,18.97 0 bottom
J1  6.75,5.75 0 top
J2  24.75,5.75 0 top
J3  42.75,5.75 0 top
J4  42.78,44.25 180 top
J5  25,44.25 180 top
J6  7,44.31 180 top
L1  10.78,34.59 180 bottom
L2  14.91,34.66 180 bottom
L3  39.53,33.69 0 bottom
MEGA_MISO  34,36.34 0 bottom
MEGA_MOSI  31.12,34.16 0 bottom
MEGA_SCK  25.94,34.12 0 bottom
MEGA_VCC  32.53,19.56 0 bottom
R1  3.25,4.25 270 bottom
R2  3.25,7.25 270 bottom
R3  22.5,6 270 bottom
R4  21,6 90 bottom
R5  29.12,7.62 0 bottom
R6  28.47,5.47 270 bottom
R7  39.6,3.54 270 bottom
R8  37.22,4.69 180 bottom
R9  46.75,10.44 270 bottom
R10  46.78,7.34 270 bottom
R11  43.83,59.27 0 bottom  (outside the outline)
R12  47.23,58.52 180 bottom  (outside the outline)
R13  11.75,7.5 0 bottom
R14  10.75,5.5 270 bottom
R15  37.13,38.02 90 bottom
R16  34.15,56.92 90 bottom  (outside the outline)
R17  21.47,45.02 90 bottom
R18  28.81,41.99 90 bottom
R19  30.38,55.6 90 bottom  (outside the outline)
R20  21.71,41.79 90 bottom
R21  9.53,45.22 270 bottom
R22  11.66,45.88 0 bottom
R23  3.76,40.31 90 bottom
R24  3.76,43.35 90 bottom
R25  41.04,29.52 315 top
R26  40.13,28.59 315 top
R27  28.98,32.79 270 bottom
R28  41.78,24.06 180 top
R29  41.77,25.45 180 top
R30  28.97,24.65 180 bottom
R31  4.19,28.19 0 top
R32  2.47,27.56 0 top
R33  47.23,32.21 180 bottom
R34  47.17,33.58 0 bottom
R35  40.21,30.98 45 bottom
R36  2.25,28.66 0 top
R37  36.28,20.53 90 bottom
R38  6.75,22.72 180 bottom
R39  34.97,29.96 45 bottom
R40  6.75,21.59 180 bottom
RESET  40.75,28.72 0 bottom
U1  48,25 180 top
U3  2.88,33.78 270 bottom
U$1  43.58,32.46 180 bottom
U$2  28.31,28.47 0 bottom
U$3  32.62,25 223.3 top
U$4  35.97,25.31 90 bottom
U$5  2.03,22.53 180 bottom
U$6  15.78,24.09 180 bottom

### Tracks (layer width: path | path; a pad name or v marks a point on that pad's centre or on a via)
3V3  (via drill 0.33, 0.33 pad 0.25)  (7 unrouted)
  Top 0.152: U$3.10 37,31.81 37.97,31.81 v38.47,31.28 38.62,31.12 38.62,29.84 | U$3.6 37.61,28.76 38.62,29.78 38.62,29.84 | R26.1 39.42,29.05 38.62,29.84 | v30.44,24.66 30.56,24.53 30.56,23 30.31,22.75 29.38,22.75 29.22,22.59 v29.22,22.31
  Bottom 0.152: U$6.J1 U$6.J2 | v38.47,31.28 38.72,31.28 39.16,31.72 39.12,33.69 L3.2 | U$6.H18 U$6.I18 | U$2.8 30.27,31.16 30.75,31.16 | 30.41,24.62 29.64,24.62 R30.2 v30.44,24.66 | v29.22,22.31 29.34,22.28 29.41,22.28
  pour Bottom (rank 6): 0,0 0,50 50,50 50,0
3V3_GOOD  (1 unrouted)
  Bottom 0.152: U$4.19 35.22,29 35.72,29.5 38.69,29.5 41.41,32.22 42.17,32.22 U$1.2
AIN1_N  (via drill 0.33)
  Top 0.152: U$3.38 29.45,17.5 29.45,17.26 28.99,16.8 arc-45 20.16,13.12 15.81,13.12 14.63,14.31 5.54,14.31 C4.+ 5.35,12.63 v5.22,12.5
  Bottom 0.152: C13.1 5.22,12.07 v5.22,12.5
AIN1_P  (1 unrouted)
  Top 0.152: C25.+ 12.82,11.1 C26.1 arc-105 9.68,12.94 arc-103 10.81,14 14.5,14 15.69,12.82 20.16,12.82 arc45 29.2,16.58 29.67,17.05 29.93,17.05 U$3.39
AIN2_N
  Top 0.152: C2.1 14.69,5.1 C1.+ 18.46,7.56 20.34,7.56 22.97,10.19 24.48,11.61 24.52,11.64 26.44,13.56 33.94,13.56 arc90 35.6,15.22 arc42 34.89,17.09 arc15 U$3.40
AIN2_P  (via drill 0.33)
  Top 0.152: v31.91,11.34 33.26,11.34 | 33.26,11.34 C3.+ | 33.26,11.34 32.72,10.49 31.16,10.5 arc66 28.88,10.09 arc-133 25.34,11.62 arc-44 25.62,12.31 arc-1 26.56,13.25 33.94,13.25 arc90 35.9,15.22 arc42 35.11,17.29 arc-19 U$3.41
  Bottom 0.152: C5.1 v31.9,11.34 v31.91,11.34
AIN3_N
  Top 0.152: C7.1 C6.+ 33.98,4.85 35.91,6.78 35.91,9.62 38.78,12.5 38.78,12.82 38.55,13.05 arc-36 36.76,16.54 arc41 35.97,17.91 35.78,17.91 U$3.42
AIN3_P  (via drill 0.33)
  Top 0.152: C8.+ 43,14.75 v42.41,15.34 arc209 41.41,13.66 arc-138 41.5,12.56 arc-45 39.59,12.44 39.34,12.69 38.77,13.26 arc-36 37.06,16.59 arc41 36.16,18.15 36.16,18.45 U$3.43
  Bottom 0.152: v42.41,15.34 40.76,15.34 C9.1 v42.4,15.35 v42.41,15.34
AOUT1_N  (2 unrouted)
AOUT1_P  (2 unrouted)
AOUT2_N  (2 unrouted)
AOUT2_P  (2 unrouted)
AOUT3_N  (2 unrouted)
AOUT3_P  (2 unrouted)
FB  (2 unrouted)
FILT+
  Top 0.15: U$3.47 37.33,20.92 38.06,20.19 39.77,20.19 C34.1 39.85,18.43 C33.1
GND  (via drill 0.33, 0.33 pad 0.25, 0.5 pad 0.25)  (21 unrouted)
  Top 0.15: C34.2 42.55,20.11 42.66,20.22 42.66,20.66 v42.59,20.72 | v12.19,29.62 14.12,29.62 v14.59,29.59 | J1.1 v3.34,2.78 | v10.84,1.75 12.72,1.75 C2.2 | v38.94,2.81 37.39,2.81 J3.1
  Top 0.152: v21.91,2.78 J2.1 | v28.62,1.53 30.65,1.53 C7.2 | C30.2 38.48,17.92 38.84,17.88 38.59,16.03 v38.47,16 | v37.41,31.06 36.27,30.18 U$3.9 | v35.12,26.06 35.12,25.22 36.09,24.25 36.09,23.11 U$3.48 | v24.38,29.81 23.88,29.16 23.88,28.62 24.36,28.14 C22.2 | C33.2 v44.28,18.38 | v6.28,18.19 6.28,17.78 | v6.38,26.16 6.38,26.53
  Bottom 0.1: U$1.9 45.46,33.69
  Bottom 0.15: C42.2 C43.2 42.38,21.48 | 42.38,21.48 C37.2 | v42.59,20.72 42.59,21.26 42.38,21.48 | C46.2 5.89,32.35 C24.2 | C23.2 16.68,36.51 16.28,36.91 12.28,36.91 12.09,36.72 C28.2 | C28.2 | C24.2 8.79,32.5 9.44,32.5 9.78,31.94 9.78,30.25 10,30.03 10.31,30.03 10.78,30.49 U$6.R4 U$6.R5 | C28.2 9.6,35.91 8.12,34.44 8.12,33.59 C24.2 | U$6.R5 U$6.S5 | U$6.R5 11.78,30.09 v12.19,29.62 | v14.59,29.59 14.81,29.69 14.97,29.84 14.97,30.48 U$6.R9 | U$6.R10 U$6.S10 | C13.2 4.56,9.29 4.56,4.09 4.07,3.6 R1.2 3.34,3.51 v3.34,2.78 | R14.2 10.75,1.84 v10.84,1.75 | v38.94,2.81 39.01,2.89 R7.2 40.58,2.89 44.38,6.69 R10.2
  Bottom 0.152: R3.2 22.5,3.38 v21.91,2.78 | C5.2 28.34,11.34 27.47,10.47 27.47,5.09 27.5,5.06 28.23,5.06 R6.2 28.47,1.69 v28.62,1.53 | v38.47,16 38.47,15.93 C9.2 | U$6.G14 U$6.G18 | U$6.R9 U$6.R10 | C41.2 45.39,36.16 C27.2 | C31.2 37.25,31.19 v37.41,31.06 | U$4.EP 36.72,24.56 U$4.3 36.72,25.44 36.84,25.56 | 36.84,25.56 U$4.28 | 36.84,25.56 35.69,25.56 v35.12,26.06 | 33.31,33.53 33.31,33.44 35.12,31.62 35.59,31.62 36.12,32.16 | U$2.PAD 26.78,30 25.66,30 25.53,29.88 v24.38,29.81 | v44.28,18.38 44.47,18.56 GND.TP | C44.2 6.31,18.22 v6.28,18.19 | U$5.GND 4.88,24.79 5.56,25.47 6.31,25.47 C40.2 v6.38,26.16
  other vias: 35.12,24.47 36.72,24.47 36.72,26.06 33.31,33.56 14.59,25.31 16.97,25.28 18.59,26.88 14.59,22.88 17,22.88 18.59,21.25 12.97,21.25 15.78,24.09
  pour Top (rank 3): 0,0 0,50 49.97,50 49.97,0
  pour Bottom: 19.28,20.59 12.31,20.59 12.31,25.19 13.91,25.19 13.91,27.06 12.31,27.06 12.31,27.53 19.28,27.53
LED_N  (1 unrouted)
  Bottom 0.152: U$4.6 35.22,22.32 35.32,22.22 35.32,22.06 34.19,20.93 31.03,20.93 30.13,20.03 30.13,13.53 29.19,12.59 21.34,12.59 19.78,14.15 15.56,14.15 13.34,11.93 6.56,11.93 6.31,12.19 6.31,14.5 5.21,15.59 5.21,18.78
LED_P  (1 unrouted)
  Bottom 0.152: U$4.5 35.72,22.32 35.62,22.22 35.62,21.94 34.31,20.63 31.16,20.63 30.43,19.91 30.43,13.41 29.31,12.29 21.22,12.29 19.66,13.85 15.69,13.85 13.47,11.63 6.44,11.63 6,12.06 6,14.37 4.91,15.47 4.91,18.78
MEGA_VCC  (1 unrouted)
  Bottom 0.15: U$4.32 38.9,23.56 C42.1
  Bottom 0.152: 36.75,21.78 37.66,21.78 38.47,22.59 U$4.32 | U$4.27 39.41,26.06 40.03,26.69 41.28,26.69 42.03,25.94 42.03,24.59 42.19,24.44 42.19,23.59 42.72,23.06 42.72,22.28 42.31,21.88 41.81,21.88 41.56,22.12 40.28,22.12 39.69,22.72 C42.1 | U$4.4 36.22,21.44 R37.2
N$1  (via drill 0.5 pad 0.25)
  Top 0.15: v11.12,8.56 11.99,8.91 J1.2
  Bottom 0.15: R14.1 10.75,7.15 R13.2 11.1,8.21 v11.12,8.56
N$2  (via drill 0.6)
  Top 0.254: J1.3 1.72,8.98 v1.72,7.62
  Bottom 0.254: v1.72,7.62 2.74,6.6 R2.2 R1.1
N$3  (via drill 0.6)
  Top 0.254: v2.12,12.44 2.15,12.46 C4.-
  Bottom 0.254: R2.1 2.78,8.37 2.78,10.91 2.12,11.56 v2.12,12.44
N$4  (1 unrouted)
N$5  (via drill 0.5 pad 0.25)
  Top 0.15: v13.78,7.5 15.6,7.5 C25.-
  Bottom 0.15: R13.1 v13.78,7.5
N$6
  Bottom 0.152: MEGA_VCC.TP 32.65,19.68 R37.1
N$7
  Bottom 0.254: U3.3 1.73,31.74 3.09,30.38 3.88,30.38 4.59,29.66 U$6.Q1
N$8  (via drill 0.33)
  Top 0.152: J2.3 19.37,8.97 v20.41,8.97
  Bottom 0.152: v20.41,8.97 21,8.38 R4.2 R3.1
N$9  (via drill 0.33)
  Top 0.152: v17.94,4.47 17.94,3.84 C1.-
  Bottom 0.152: R4.1 21,5 20.75,4.75 18.22,4.75 v17.94,4.47
N$10  (1 unrouted)
N$11  (via drill 0.33)
  Top 0.152: J2.2 28.91,9.28 v28.53,8.91
  Bottom 0.152: v28.53,8.91 28.53,7.68 R5.2 R6.1
N$12  (1 unrouted)
N$13  (via drill 0.33 pad 0.25)
  Top 0.152: v10.22,21.69 10.28,21.69 10.5,21.47 10.5,21.19 10.41,21.09 8.38,21.09 7.59,20.31 v4.62,20.31
  Bottom 0.152: U$6.G2 v10.21,21.69 v10.22,21.69 | v4.62,20.31 4.62,20.98 U$5.VBUS
N$14
  Bottom 0.152: 9.41,17.69 8.97,17.25 8.97,15.91
N$15  (via drill 0.5 pad 0.25)
  Top 0.15: J3.3 37.43,8.98 39.03,7.38 v39.03,5.69
  Bottom 0.15: R7.1 38.94,4.19 | 38.94,4.19 38.37,4.19 R8.2 | v39.03,5.69 39.03,4.28 38.94,4.19
N$16  (via drill 0.33)
  Top 0.152: C6.- 33.84,1.91 v35.47,3.53
  Bottom 0.152: v35.47,3.53 35.47,3.59 R8.1
N$17
  Bottom 0.152: 10.19,17.72 9.78,17.31 9.78,15.84
N$18  (via drill 0.33)
  Top 0.152: J3.2 48.36,10.58 v48.34,10.59
  Bottom 0.15: R9.2 46.75,8.03 R10.1
  Bottom 0.152: v48.34,10.59 48.25,10.59 48.06,10.78 47.74,10.78 R9.2
N$19  (via drill 0.33)
  Top 0.152: v47.94,12.31 47.94,14.41 C8.-
  Bottom 0.152: R9.1 46.75,11.12 v47.94,12.31
N$20  (1 unrouted)
N$21  (via drill 0.33 pad 0.25)
  Top 0.152: v10.22,22.75 10.22,23.03 10.12,23.12 8.31,23.12 7.81,23.62 4.12,23.62 v3.69,23.19
  Bottom 0.152: U$6.H2 9.96,22.49 v10.22,22.75 | v3.69,23.19 U$5.ID
N$22  (2 unrouted)
N$23  (1 unrouted)
N$24  (via drill 0.33 pad 0.25)
  Top 0.152: R28.1 42.46,24.03 v42.94,24.03 43.26,24.35 U1.D-
  Bottom 0.152: C37.1 42.96,24.06 v42.94,24.03
N$25  (2 unrouted)
N$26  (1 unrouted)
N$27
  Bottom 0.152: 10.97,17.72 10.97,17.59 10.59,17.22 10.59,15.84
N$28
  Bottom 0.152: 11.78,17.69 11.78,17.66 11.38,17.25 11.38,15.84
N$29  (2 unrouted)
N$30  (1 unrouted)
N$31
  Top 0.152: U$3.1 40.21,26.81 40.44,26.81 41.88,28.25 41.88,28.62 41.5,29 R25.2
N$32  (2 unrouted)
N$33  (1 unrouted)
N$34
  Top 0.152: R26.2 39.35,26.89 U$3.2
N$36  (2 unrouted)
N$37  (1 unrouted)
N$39  (2 unrouted)
N$40  (1 unrouted)
N$41  (via drill 0.33 pad 0.25)
  Top 0.152: R29.1 42.43,25.44 v43,25.44 43.44,25 U1.D+
  Bottom 0.152: C38.1 43.01,25.45 v43,25.44
N$46
  Bottom 0.152: U$2.7 28.96,32.03 R27.2
PROG_USB_N  (via drill 0.33 pad 0.25)
  Top 0.152: v40.31,24.37 40.19,24.66 40.56,24.66 40.56,24.63 R28.2
  Bottom 0.152: U$4.30 40.09,24.56 40.19,24.66 v40.31,24.37
PROG_USB_P  (via drill 0.33 pad 0.25)
  Top 0.152: v40.31,25.26 40.19,24.96 40.63,24.96 R29.2
  Bottom 0.152: U$4.29 40.09,25.06 40.19,24.96 v40.31,25.26
RESET  (via drill 0.33 pad 0.25)  (1 unrouted)
  Top 0.152: v32.34,23.38 32.34,26.94 32.56,27.16 33.44,27.16 34.19,27.91 34.19,28.84 v33.75,29.28 | v32.59,32.5 33.72,32.5 35,33.78 37.69,33.78 39.91,31.56 arc90 41.84,29.62 42.12,29.62 42.75,29 v42.75,28.5
  Bottom 0.152: U$2.3 28.32,25.11 R30.1 28.32,23.71 29,23.03 32,23.03 v32.34,23.38 | U$4.24 37.97,27.81 39,28.84 | 39,28.84 R35.1 | 39,28.84 39.12,28.72 RESET.TP 41.12,28.72 41.97,27.88 42.12,27.88 v42.75,28.5 | v33.75,29.28 33.75,29.47 33.16,30.06 33.16,31.94 v32.59,32.5
ROM_CS
  Bottom 0.152: U$6.P19 22.99,28.91 23.5,28.88 25.44,26.94 29.12,26.94 30.26,25.8 U$2.1 30.56,26.06 U$4.14
ROM_MISO  (via drill 0.33 pad 0.25)  (1 unrouted)
  Top 0.152: v31.69,24.53 31.69,27.66 32.28,28.22 v33.12,28.22
  Bottom 0.152: U$6.O19 23.01,28.06 23.53,28.03 25.06,26.5 28.38,26.5 28.96,25.91 | 28.96,25.91 U$2.2 | 28.96,25.91 28.94,25.89 28.94,23.94 29.34,23.53 31.12,23.53 31.69,24.12 v31.69,24.53 | v33.12,28.22 33.91,28.22 U$4.17
ROM_MOSI
  Bottom 0.152: U$6.R19 23.01,30.47 23.56,30.69 24.82,31.17 U$2.5 27.01,32.78 29.75,32.78 | U$4.16 32.69,27.06 32.19,27.56 32.19,30.38 30.94,30.38 30.91,30.41 29.84,30.41 29.59,30.66 29.59,31.56 29.97,31.94 29.97,32.56 29.75,32.78 | 29.75,32.78 MEGA_MOSI.TP
ROM_SCK  (via drill 0.33 pad 0.25)
  Top 0.152: v27.5,34.12 28.03,33.59 28.03,32.38 v27.78,32.09
  Bottom 0.152: U$6.Q19 23.05,29.62 23.66,30.06 24.38,30.59 27.38,30.59 27.66,30.69 | 27.66,30.69 U$2.6 27.66,31.98 v27.78,32.09 | 27.66,30.69 28.32,30.03 30.62,30.03 31.22,29.44 31.22,27.03 31.69,26.56 U$4.15 | MEGA_SCK.TP v27.5,34.12
SW  (1 unrouted)
  Bottom 0.152: U$1.4 U$1.3
  pour Bottom (no thermals): 42.34,32.59 40.5,32.59 40.5,34.75 42.34,34.75
SW1
  Bottom 0.406: U$6.R6 U$6.S6 12.58,33.47 L1.P$2
SW2
  Bottom 0.406: U$6.R11 U$6.S11 L2.P$2
TRACK/SS  (5 unrouted)
USB2_N
  Bottom 0.152: R40.2 7.87,21.59 8.19,21.91 8.37,21.91 U$6.G1
USB2_P
  Bottom 0.152: R38.2 7.68,22.72 8.19,22.21 8.3,22.21 U$6.H1
USB2R_N
  Bottom 0.152: U$5.D- 5.81,21.88 R40.1 6.1,20.39 C44.1
USB2R_P
  Bottom 0.152: U$5.D+ 5.91,22.53 R38.1 6.1,23.82 C40.1
USB_5V  (via drill 0.33 pad 0.25, 0.5 pad 0.25)  (2 unrouted)
  Top 0.15: v42.03,22.69 44.47,22.78 v44.62,22.94
  Top 0.152: U$3.37 28.82,17.78 C29.1 | U$3.46 37.77,19.59 C30.1 | U1.VBUS 45.15,23.46 v44.62,22.94 | 45.16,23.44 v45.66,22.94
  Bottom 0.15: U$4.31 39.65,24.06 C43.1 42.15,22.68 v42.03,22.69
  Bottom 0.152: U$1.16 U$1.15 U$1.14 | v44.62,22.94 44.62,23.19
  pour Bottom: 44.41,22.44 45.91,22.44 46.19,22.72 46.19,28.16 43.97,30.38 43.94,30.41 43.94,31.25 42.72,31.25 42.72,30.44 42.72,29.72 44.38,28.06 44.38,22.47
VDD1V8
  Bottom 0.152: L2.P$1 15.21,33.67 15.21,35.91 C23.1
  Bottom 0.406: L2.P$1 arc90 14.98,33.41 U$6.S9 U$6.S8 U$6.R8
VDDCORE
  Bottom 0.152: L1.P$1 10.99,33.71 | C24.1 10.98,33.47
  Bottom 0.406: U$6.R3 U$6.S3 U$6.S4 10.98,33.47 L1.P$1
VQ
  Top 0.15: C35.1 25.96,19.65 C36.1 28.66,18.54 U$3.36
XMOS_RST  (4 unrouted)
  Bottom 0.152: U$6.I2 9.89,23.29 10.81,24.22 10.81,25.31